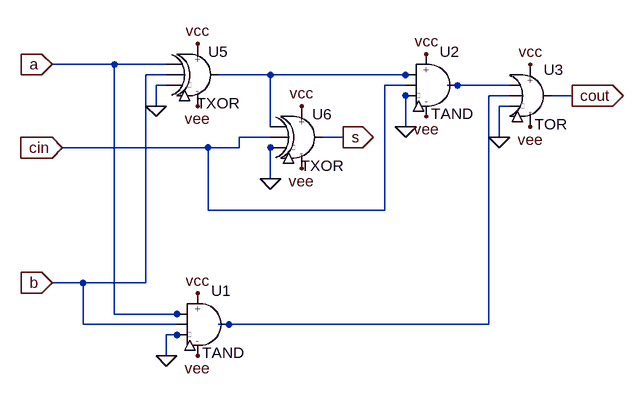
[diagram p0: schematic BFTA.asc]
BFTA.asc, the LTspice schematic file:
Version 4
SHEET 1 1556 748
WIRE -528 -320 -624 -320
WIRE -448 -320 -528 -320
WIRE -448 -304 -480 -304
WIRE -288 -304 -368 -304
WIRE -80 -304 -288 -304
WIRE -64 -304 -80 -304
WIRE -448 -288 -464 -288
WIRE -80 -288 -112 -288
WIRE 0 -288 -16 -288
WIRE 80 -288 0 -288
WIRE -64 -272 -80 -272
WIRE 80 -272 48 -272
WIRE 176 -272 144 -272
WIRE -464 -256 -464 -288
WIRE 80 -256 64 -256
WIRE -288 -224 -288 -304
WIRE -80 -224 -80 -272
WIRE -288 -208 -336 -208
WIRE -176 -208 -208 -208
WIRE 64 -208 64 -256
WIRE -384 -192 -608 -192
WIRE -336 -192 -336 -208
WIRE -336 -192 -384 -192
WIRE -272 -192 -288 -192
WIRE -288 -144 -288 -192
WIRE -384 -96 -384 -192
WIRE -112 -96 -112 -288
WIRE -112 -96 -384 -96
WIRE -576 16 -624 16
WIRE -480 16 -480 -304
WIRE -480 16 -576 16
WIRE -528 64 -528 -320
WIRE -432 64 -528 64
WIRE -416 64 -432 64
WIRE -576 80 -576 16
WIRE -432 80 -576 80
WIRE -352 80 -368 80
WIRE 48 80 48 -272
WIRE 48 80 -352 80
WIRE -432 96 -448 96
WIRE -416 96 -432 96
WIRE -448 128 -448 96
FLAG -624 -320 a
IOPIN -624 -320 In
FLAG -624 16 b
IOPIN -624 16 In
FLAG -176 -208 s
IOPIN -176 -208 Out
FLAG -400 -352 vcc
FLAG -400 32 vcc
FLAG -400 -256 vee
FLAG -400 128 vee
FLAG -608 -192 cin
IOPIN -608 -192 In
FLAG -240 -256 vcc
FLAG -240 -160 vee
FLAG -48 -336 vcc
FLAG -48 -240 vee
FLAG 176 -272 cout
IOPIN 176 -272 Out
FLAG 112 -320 vcc
FLAG 112 -224 vee
FLAG -464 -256 0
FLAG -288 -144 0
FLAG -448 128 0
FLAG -80 -224 0
FLAG 64 -208 0
SYMBOL TXOR -400 -304 R0
SYMATTR InstName U5
SYMBOL TXOR -240 -208 R0
SYMATTR InstName U6
SYMBOL TAND -384 80 R0
SYMATTR InstName U1
SYMBOL TAND -32 -288 R0
SYMATTR InstName U2
SYMBOL TOR 112 -272 R0
SYMATTR InstName U3

The netlist it stands for:
* BFTA.asc
XU5 a b vcc vee N001 0 TXOR  ; pins a b vcc vee out gnd
XU6 N001 cin vcc vee s 0 TXOR  ; pins a b vcc vee out gnd
XU1 a b vcc vee N003 0 TAND  ; pins a b vcc vee out gnd
XU2 N001 cin vcc vee N002 0 TAND  ; pins a b vcc vee out gnd
XU3 N002 N003 vcc vee cout 0 TOR  ; pins a b vcc vee out gnd
.lib /Users/manoelribeiroalmeida/dev/trit/LTspice/TXOR.sub
.lib /Users/manoelribeiroalmeida/dev/trit/LTspice/TAND.sub
.lib /Users/manoelribeiroalmeida/dev/trit/LTspice/TOR.sub
.backanno
.end